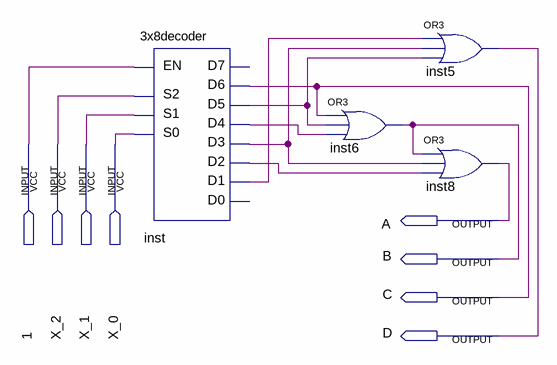
[diagram p0: schematic sheet]
// Quartus schematic hw6p3.bdf as structural Verilog: 4 symbols, 8 pins
module hw6p3 (
  input  \1 ,
  input  X_2,
  input  X_1,
  input  X_0,
  output A,
  output B,
  output C,
  output D
);

  wire inst_d1, inst_d2, inst_d3, inst_d4, inst_d5;

  \3x8decoder  inst (
    .S2(X_2), .S1(X_1), .S0(X_0), .EN(\1 ), .D6(C), .D5(inst_d5), .D4(inst_d4), .D3(inst_d3), .D2(inst_d2),
    .D1(inst_d1));  // open: D7, D0
  or inst6 (B, C, inst_d5, inst_d4);
  or inst5 (D, inst_d1, inst_d3, inst_d5);
  or inst8 (A, B, inst_d3, inst_d2);
endmodule
